# Altium schematic sheet BMS_Logic.SchDoc
size 558 x 431 mm; SheetNumber: 4; SheetTotal: 5
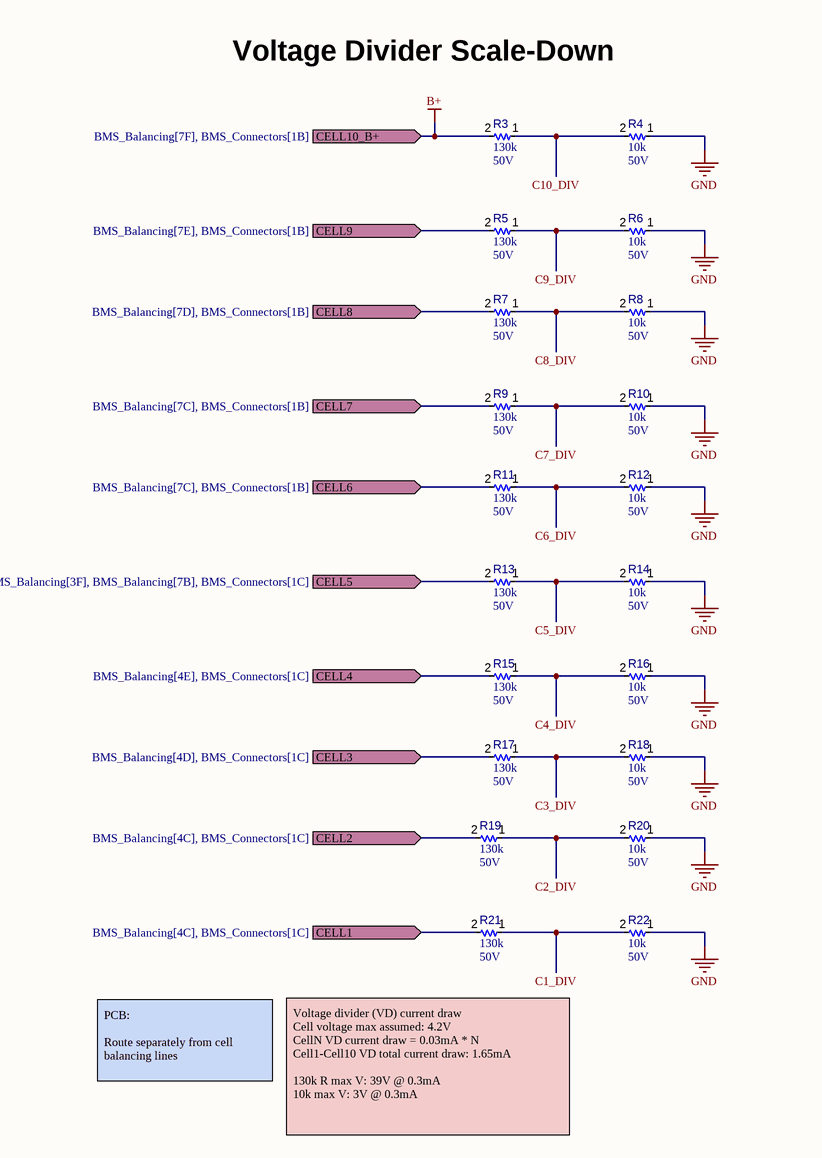
[diagram p0: BMS_Logic.SchDoc, top left]
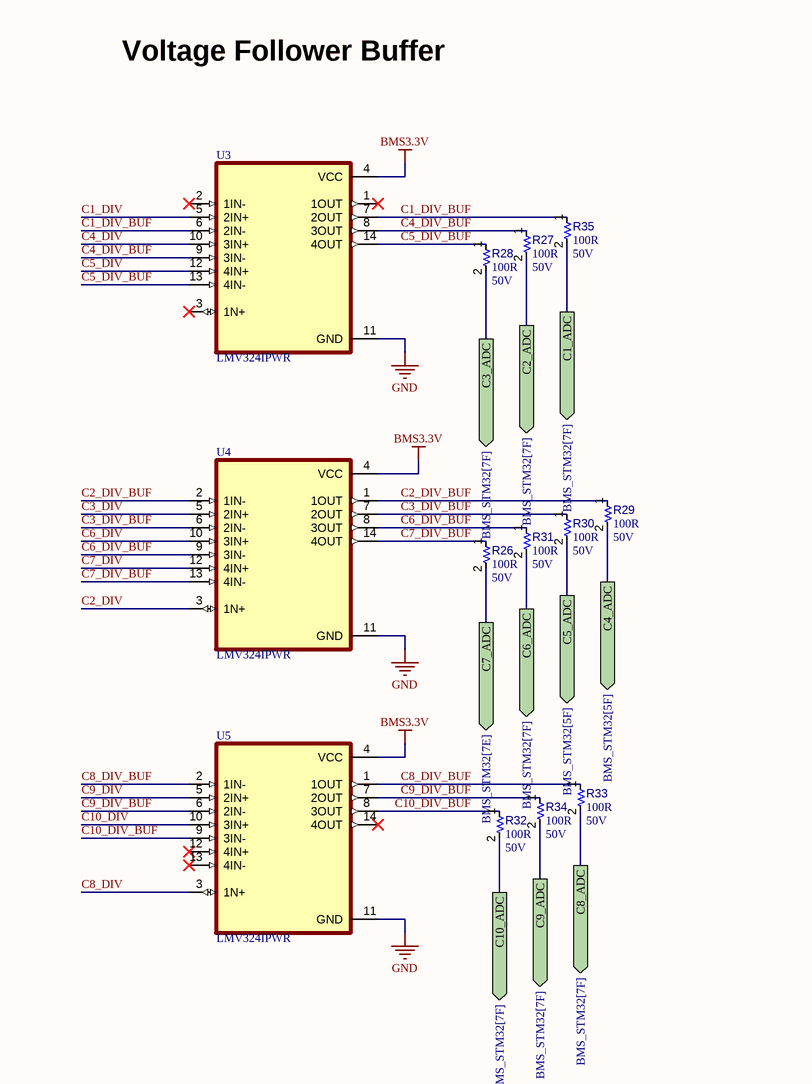
[diagram p1: BMS_Logic.SchDoc, top right]
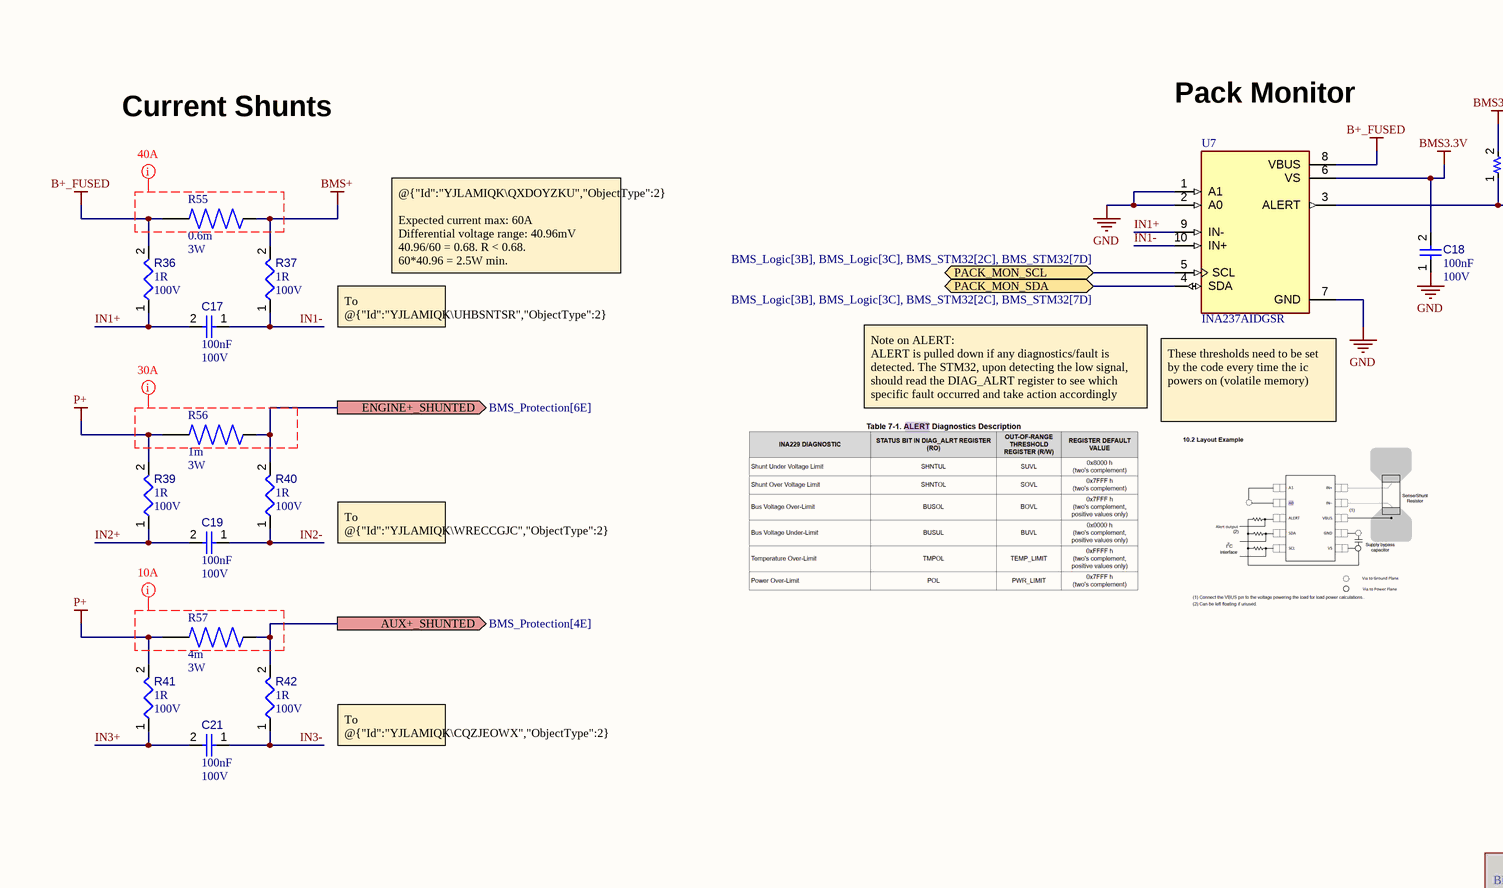
[diagram p2: BMS_Logic.SchDoc, bottom left]
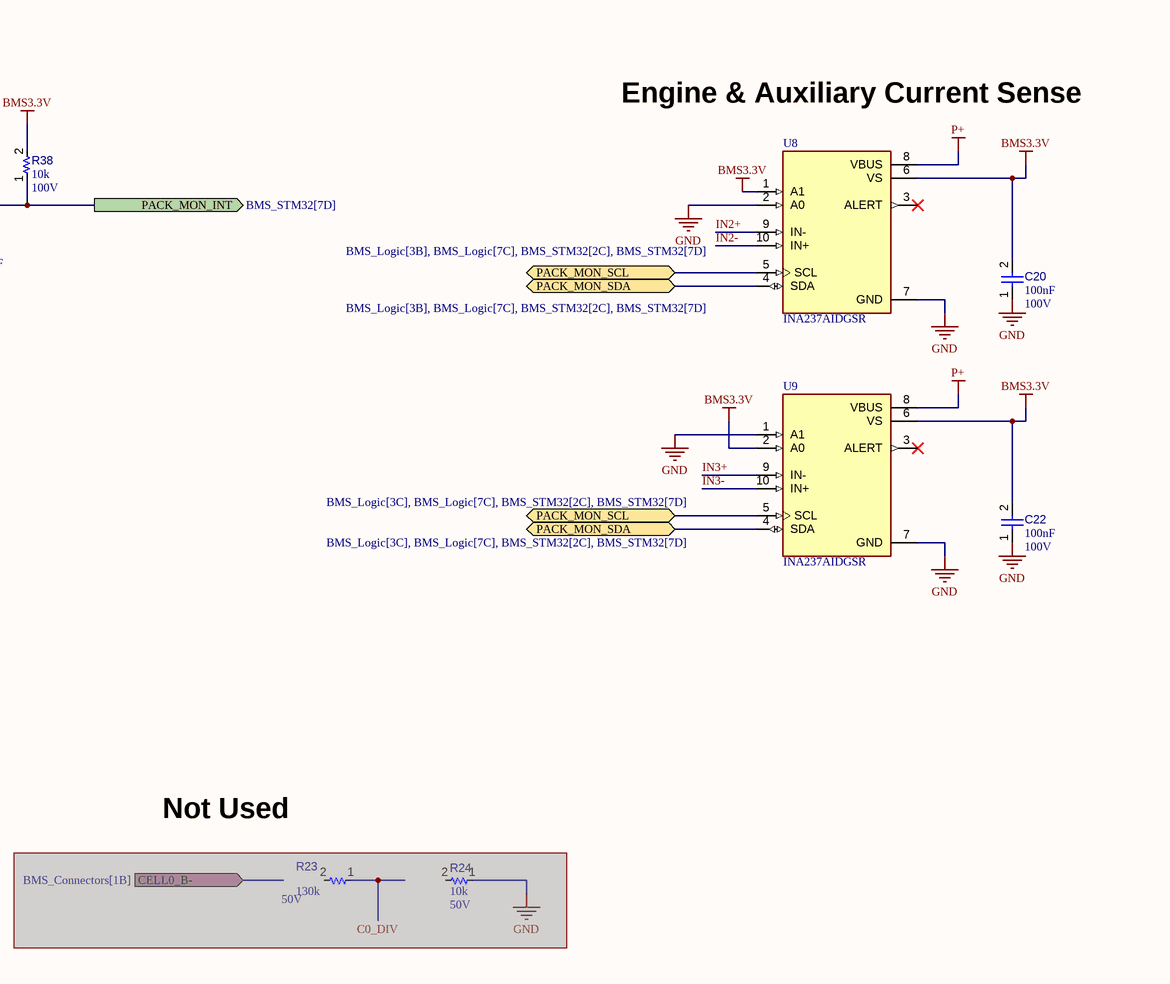
[diagram p3: BMS_Logic.SchDoc, bottom right]

## Parts
C17  value 100nF  Voltage Rating: 100V  [CAPC1608X90X40NL10T20]  (hidden comment: CC0603KRX7R0BB104)
C18  value 100nF  Voltage Rating: 100V  [CAPC1608X90X40NL10T20]  (hidden comment: CC0603KRX7R0BB104)
C19  value 100nF  Voltage Rating: 100V  [CAPC1608X90X40NL10T20]  (hidden comment: CC0603KRX7R0BB104)
C20  value 100nF  Voltage Rating: 100V  [CAPC1608X90X40NL10T20]  (hidden comment: CC0603KRX7R0BB104)
C21  value 100nF  Voltage Rating: 100V  [CAPC1608X90X40NL10T20]  (hidden comment: CC0603KRX7R0BB104)
C22  value 100nF  Voltage Rating: 100V  [CAPC1608X90X40NL10T20]  (hidden comment: CC0603KRX7R0BB104)
R3  value 130k  Voltage Rating: 50V  [RESC0402(1005)_L]  (hidden comment: RC0402FR-07130KL)
R4  value 10k  Voltage Rating: 50V  [RESC0402(1005)_L]  (hidden comment: RC0402FR-0710KL)
R5  value 130k  Voltage Rating: 50V  [RESC0402(1005)_L]  (hidden comment: RC0402FR-07130KL)
R6  value 10k  Voltage Rating: 50V  [RESC0402(1005)_L]  (hidden comment: RC0402FR-0710KL)
R7  value 130k  Voltage Rating: 50V  [RESC0402(1005)_L]  (hidden comment: RC0402FR-07130KL)
R8  value 10k  Voltage Rating: 50V  [RESC0402(1005)_L]  (hidden comment: RC0402FR-0710KL)
R9  value 130k  Voltage Rating: 50V  [RESC0402(1005)_L]  (hidden comment: RC0402FR-07130KL)
R10  value 10k  Voltage Rating: 50V  [RESC0402(1005)_L]  (hidden comment: RC0402FR-0710KL)
R11  value 130k  Voltage Rating: 50V  [RESC0402(1005)_L]  (hidden comment: RC0402FR-07130KL)
R12  value 10k  Voltage Rating: 50V  [RESC0402(1005)_L]  (hidden comment: RC0402FR-0710KL)
R13  value 130k  Voltage Rating: 50V  [RESC0402(1005)_L]  (hidden comment: RC0402FR-07130KL)
R14  value 10k  Voltage Rating: 50V  [RESC0402(1005)_L]  (hidden comment: RC0402FR-0710KL)
R15  value 130k  Voltage Rating: 50V  [RESC0402(1005)_L]  (hidden comment: RC0402FR-07130KL)
R16  value 10k  Voltage Rating: 50V  [RESC0402(1005)_L]  (hidden comment: RC0402FR-0710KL)
R17  value 130k  Voltage Rating: 50V  [RESC0402(1005)_L]  (hidden comment: RC0402FR-07130KL)
R18  value 10k  Voltage Rating: 50V  [RESC0402(1005)_L]  (hidden comment: RC0402FR-0710KL)
R19  value 130k  Voltage Rating: 50V  [RESC0402(1005)_L]  (hidden comment: RC0402FR-07130KL)
R20  value 10k  Voltage Rating: 50V  [RESC0402(1005)_L]  (hidden comment: RC0402FR-0710KL)
R21  value 130k  Voltage Rating: 50V  [RESC0402(1005)_L]  (hidden comment: RC0402FR-07130KL)
R22  value 10k  Voltage Rating: 50V  [RESC0402(1005)_L]  (hidden comment: RC0402FR-0710KL)
R23  value 130k  Voltage Rating: 50V  [RESC0402(1005)_L]  (hidden comment: RC0402FR-07130KL)  (masked out: inside a compile mask, not in the netlist)
R24  value 10k  Voltage Rating: 50V  [RESC0402(1005)_L]  (hidden comment: RC0402FR-0710KL)  (masked out: inside a compile mask, not in the netlist)
R26  value 100R  Voltage Rating: 50V  [RESC0402(1005)_L]  (hidden comment: RC0402FR-07100RL)
R27  value 100R  Voltage Rating: 50V  [RESC0402(1005)_L]  (hidden comment: RC0402FR-07100RL)
R28  value 100R  Voltage Rating: 50V  [RESC0402(1005)_L]  (hidden comment: RC0402FR-07100RL)
R29  value 100R  Voltage Rating: 50V  [RESC0402(1005)_L]  (hidden comment: RC0402FR-07100RL)
R30  value 100R  Voltage Rating: 50V  [RESC0402(1005)_L]  (hidden comment: RC0402FR-07100RL)
R31  value 100R  Voltage Rating: 50V  [RESC0402(1005)_L]  (hidden comment: RC0402FR-07100RL)
R32  value 100R  Voltage Rating: 50V  [RESC0402(1005)_L]  (hidden comment: RC0402FR-07100RL)
R33  value 100R  Voltage Rating: 50V  [RESC0402(1005)_L]  (hidden comment: RC0402FR-07100RL)
R34  value 100R  Voltage Rating: 50V  [RESC0402(1005)_L]  (hidden comment: RC0402FR-07100RL)
R35  value 100R  Voltage Rating: 50V  [RESC0402(1005)_L]  (hidden comment: RC0402FR-07100RL)
R36  value 1R  Voltage Rating: 100V  [RESC0805(2012)_L]  (hidden comment: RC0805FR-071RL)
R37  value 1R  Voltage Rating: 100V  [RESC0805(2012)_L]  (hidden comment: RC0805FR-071RL)
R38  value 10k  Voltage Rating: 100V  [RESC0402(1005)_L]  (hidden comment: ERJ2GEJ103X)
R39  value 1R  Voltage Rating: 100V  [RESC0805(2012)_L]  (hidden comment: RC0805FR-071RL)
R40  value 1R  Voltage Rating: 100V  [RESC0805(2012)_L]  (hidden comment: RC0805FR-071RL)
R41  value 1R  Voltage Rating: 100V  [RESC0805(2012)_L]  (hidden comment: RC0805FR-071RL)
R42  value 1R  Voltage Rating: 100V  [RESC0805(2012)_L]  (hidden comment: RC0805FR-071RL)
R55  value 0.6m  Power: 3W  [RESC6331X75N]  (hidden comment: HoSRX2512-3W-0.6m-0.5%)
R56  value 1m  Power: 3W  [RESC6331X75N]  (hidden comment: Milliohm HoJLR2512-3W-1mR-1%)
R57  value 4m  Power: 3W  [RESC6331X75N]  (hidden comment: Milliohm HoJLR2512-3W-4mR-1%)
U3  LMV324IPWR  [SOP65P640X120-14N]
U4  LMV324IPWR  [SOP65P640X120-14N]
U5  LMV324IPWR  [SOP65P640X120-14N]
U7  INA237AIDGSR  [SOP50P490X110-10N]
U8  INA237AIDGSR  [SOP50P490X110-10N]
U9  INA237AIDGSR  [SOP50P490X110-10N]

## Ports
AUX+_SHUNTED (out, see BMS_Protection[4E]), C1_ADC (out, see BMS_STM32[7F]), C2_ADC (out, see BMS_STM32[7F]), C3_ADC (out, see BMS_STM32[7F]), C4_ADC (out, see BMS_STM32[5F]), C5_ADC (out, see BMS_STM32[5F]), C6_ADC (out, see BMS_STM32[7F]), C7_ADC (out, see BMS_STM32[7E]), C8_ADC (out, see BMS_STM32[7F]), C9_ADC (out, see BMS_STM32[7F]), C10_ADC (out, see BMS_STM32[7F]), CELL0_B- (in, see BMS_Connectors[1B]), CELL1 (in, see BMS_Balancing[4C], BMS_Connectors[1C]), CELL2 (in, see BMS_Balancing[4C], BMS_Connectors[1C]), CELL3 (in, see BMS_Balancing[4D], BMS_Connectors[1C]), CELL4 (in, see BMS_Balancing[4E], BMS_Connectors[1C]), CELL5 (in, see BMS_Balancing[3F], BMS_Balancing[7B], BMS_Connectors[1C]), CELL6 (in, see BMS_Balancing[7C], BMS_Connectors[1B]), CELL7 (in, see BMS_Balancing[7C], BMS_Connectors[1B]), CELL8 (in, see BMS_Balancing[7D], BMS_Connectors[1B]), CELL9 (in, see BMS_Balancing[7E], BMS_Connectors[1B]), CELL10_B+ (in, see BMS_Balancing[7F], BMS_Connectors[1B]), ENGINE+_SHUNTED (out, see BMS_Protection[6E]), PACK_MON_INT (out, see BMS_STM32[7D]), PACK_MON_SCL (bidir, see BMS_Logic[3B], BMS_Logic[3C], BMS_STM32[2C], BMS_STM32[7D]), PACK_MON_SCL (bidir, see BMS_Logic[3B], BMS_Logic[7C], BMS_STM32[2C], BMS_STM32[7D]), PACK_MON_SCL (bidir, see BMS_Logic[3C], BMS_Logic[7C], BMS_STM32[2C], BMS_STM32[7D]), PACK_MON_SDA (bidir, see BMS_Logic[3B], BMS_Logic[3C], BMS_STM32[2C], BMS_STM32[7D]), PACK_MON_SDA (bidir, see BMS_Logic[3B], BMS_Logic[7C], BMS_STM32[2C], BMS_STM32[7D]), PACK_MON_SDA (bidir, see BMS_Logic[3C], BMS_Logic[7C], BMS_STM32[2C], BMS_STM32[7D])

## Nets
B+: R3.2 ; port CELL10_B+
B+_FUSED: R36.2 R55.1 U7.8(VBUS)
BMS3.3V: C18.2 C20.2 C22.2 R38.2 U3.4(VCC) U4.4(VCC) U5.4(VCC) U7.6(VS) U8.1(A1) U8.6(VS) U9.2(A0) U9.6(VS)
BMS+: R37.2 R55.2
GND: C18.1 C20.1 C22.1 R4.1 R6.1 R8.1 R10.1 R12.1 R14.1 R16.1 R18.1 R20.1 R22.1 U3.11(GND) U4.11(GND) U5.11(GND) U7.1(A1) U7.2(A0) U7.7(GND) U8.2(A0) U8.7(GND) U9.1(A1) U9.7(GND)
P+: R39.2 R41.2 R56.1 R57.1 U8.8(VBUS) U9.8(VBUS)
AUX+_SHUNTED: R42.2 R57.2 ; port AUX+_SHUNTED
C1_ADC: R35.2 ; port C1_ADC
C1_DIV: R21.1 R22.2 U3.5(2IN+)
C1_DIV_BUF: R35.1 U3.6(2IN-) U3.7(2OUT)
C2_ADC: R27.2 ; port C2_ADC
C2_DIV: R19.1 R20.2 U4.3(1N+)
C2_DIV_BUF: R29.1 U4.1(1OUT) U4.2(1IN-)
C3_ADC: R28.2 ; port C3_ADC
C3_DIV: R17.1 R18.2 U4.5(2IN+)
C3_DIV_BUF: R30.1 U4.6(2IN-) U4.7(2OUT)
C4_ADC: R29.2 ; port C4_ADC
C4_DIV: R15.1 R16.2 U3.10(3IN+)
C4_DIV_BUF: R27.1 U3.8(3OUT) U3.9(3IN-)
C5_ADC: R30.2 ; port C5_ADC
C5_DIV: R13.1 R14.2 U3.12(4IN+)
C5_DIV_BUF: R28.1 U3.13(4IN-) U3.14(4OUT)
C6_ADC: R31.2 ; port C6_ADC
C6_DIV: R11.1 R12.2 U4.10(3IN+)
C6_DIV_BUF: R31.1 U4.8(3OUT) U4.9(3IN-)
C7_ADC: R26.2 ; port C7_ADC
C7_DIV: R9.1 R10.2 U4.12(4IN+)
C7_DIV_BUF: R26.1 U4.13(4IN-) U4.14(4OUT)
C8_ADC: R33.2 ; port C8_ADC
C8_DIV: R7.1 R8.2 U5.3(1N+)
C8_DIV_BUF: R33.1 U5.1(1OUT) U5.2(1IN-)
C9_ADC: R34.2 ; port C9_ADC
C9_DIV: R5.1 R6.2 U5.5(2IN+)
C9_DIV_BUF: R34.1 U5.6(2IN-) U5.7(2OUT)
C10_ADC: R32.2 ; port C10_ADC
C10_DIV: R3.1 R4.2 U5.10(3IN+)
C10_DIV_BUF: R32.1 U5.8(3OUT) U5.9(3IN-)
CELL1: R21.2 ; port CELL1
CELL2: R19.2 ; port CELL2
CELL3: R17.2 ; port CELL3
CELL4: R15.2 ; port CELL4
CELL5: R13.2 ; port CELL5
CELL6: R11.2 ; port CELL6
CELL7: R9.2 ; port CELL7
CELL8: R7.2 ; port CELL8
CELL9: R5.2 ; port CELL9
ENGINE+_SHUNTED: R40.2 R56.2 ; port ENGINE+_SHUNTED
IN1+: C17.2 R36.1 U7.9(IN-)
IN1-: C17.1 R37.1 U7.10(IN+)
IN2+: C19.2 R39.1 U8.9(IN-)
IN2-: C19.1 R40.1 U8.10(IN+)
IN3+: C21.2 R41.1 U9.9(IN-)
IN3-: C21.1 R42.1 U9.10(IN+)
PACK_MON_INT: R38.1 U7.3(ALERT) ; port PACK_MON_INT
PACK_MON_SCL: U7.5(SCL) U8.5(SCL) U9.5(SCL) ; port PACK_MON_SCL
PACK_MON_SDA: U7.4(SDA) U8.4(SDA) U9.4(SDA) ; port PACK_MON_SDA

Not connected (* = marked no-connect by the designer): U3 1(1OUT)* 2(1IN-)* 3(1N+)*; U5 12(4IN+)* 13(4IN-)* 14(4OUT)*; U8 3(ALERT)*; U9 3(ALERT)*

## Layout directives
mark named 30A: (no net found under the mark)
mark named 40A: (no net found under the mark)
mark named 10A: (no net found under the mark)

## Notes on the sheet
- Voltage Divider Scale-Down
- Voltage Follower Buffer
- PCB:
  Route separately from cell balancing lines
- Voltage divider (VD) current draw
  Cell voltage max assumed: 4.2V
  CellN VD current draw = 0.03mA * N
  Cell1-Cell10 VD total current draw: 1.65mA
  130k R max V: 39V @ 0.3mA
  10k max V: 3V @ 0.3mA
- Pack Monitor
- Engine & Auxiliary Current Sense
- Current Shunts
- @{"Id":"YJLAMIQK\QXDOYZKU","ObjectType":2}
  Expected current max: 60A
  Differential voltage range: 40.96mV
  40.96/60 = 0.68. R < 0.68.
  60*40.96 = 2.5W min.
- To @{"Id":"YJLAMIQK\UHBSNTSR","ObjectType":2}
- Note on ALERT:
  ALERT is pulled down if any diagnostics/fault is detected. The STM32, upon detecting the low signal, should read the DIAG_ALRT register to see which specific fault occurred and take action accordingly
- (near U7) These thresholds need to be set by the code every time the ic powers on (volatile memory)
- To @{"Id":"YJLAMIQK\WRECCGJC","ObjectType":2}
- To @{"Id":"YJLAMIQK\CQZJEOWX","ObjectType":2}
- Not Used
- DWG. NO.
- REV.
- SHT.
- REVISION
- DESCRIPTION
- DATE
- APPROVED
- THIS DOCUMENT AND THE DATA DISCLOSED HEREIN OR HEREWITH IS THE PROPERTY OF ALTIUM LIMITED AND MAY BE FREELY DISTRIBUTED IN WHOLE. NO RIGHTS ARE RESERVED OR EXPRESS OR IMPLIED WARANTEE GIVEN.
- ENG:
- DSN:
- APPROVALS
- PROJECT
- DOCUMENT REVISION:
- DESIGN ITEM:
- CHK:
- BOM:
- REFERENCE DOCUMENTS
- PROJECT REVISION:
- TITLE
- FAB DWG:
- PCB DWG:
- ASSY DWG:
- SCALE:
- SIZE
- C
- CAGE CODE
- FILE NAME
- DWG NO.
- SHEET
- OF
- REV

## Library data of the parts
C17-C22 = CMP-001-00017-6: Chip Capacitor, 100 nF, +/- 10%, 50 V, 0603 (1608 Metric); Capacitor Type: Ceramic; Mounting Technology: SM; Case/Package: 0603; Pins: 2; RoHS Compliant: True; Min Operating Temperature: -55°C; Max Operating Temperature: 125°C; Tolerance: 10%
R3-R24 R26-R35 = CMP-009-00065-4: 100R 0.063W 1% 0402 (1005 Metric)  SMD; Power: 63mW; Mounting Technology: SMT; Case/Package: 0402; Pins: 2; Tolerance: 1%
R36 R37 R39-R42 = CMP-009-00118-3: Chip Resistor, 1 kOhms, +/-5%, 125 mW, -55 to 155 degC, 0805; Tolerance: 5%; Power: 125mW; Case/Package: 0805; Pins: 2; Min Operating Temperature: -55°C; Max Operating Temperature: 155°C
R38 = CMP-009-00065-4: 100R 0.063W 1% 0402 (1005 Metric)  SMD; Power: 100mW; Mounting Technology: SMT; Case/Package: 0402; Pins: 2; Tolerance: 1%
R55 = CMP-009-00180-1: 0 Ohms Jumper 1W Chip Resistor 2512 (6432 Metric) - Thick Film; MF: Bourns; Source: CR2512-J_-000ELF.SchLib; SnapEDA_Link: https://www.snapeda.com/parts/CR2512-J/-000ELF/Bourns/view-part/?ref=snap; MP: CR2512-J/-000ELF; Design Item ID: CR2512-J/-000ELF; Case/Package: 6331 Bourns; Check_prices: https://www.snapeda.com/parts/CR2512-J/-000ELF/Bourns/view-part/?ref=eda
R56 R57 = CMP-009-00180-1: MF: Bourns; Source: CR2512-J_-000ELF.SchLib; SnapEDA_Link: https://www.snapeda.com/parts/CR2512-J/-000ELF/Bourns/view-part/?ref=snap; MP: CR2512-J/-000ELF; Design Item ID: CR2512-J/-000ELF; Case/Package: 6331 Bourns; Check_prices: https://www.snapeda.com/parts/CR2512-J/-000ELF/Bourns/view-part/?ref=eda
U3-U5 = CMP-014-00002-2: Quad, 5.5-V, 1-MHz, RRO operational amplifier; MF: Texas Instruments; Max Supply Current: 1.16mA; Input Offset Voltage-Max: 7mV; Power Supplies: 3/5V; Common-mode Reject Ratio-Nom: 65dB; Voltage Gain-Min: 10000; Slew Rate: 1V/µs; Bias Current-Max (IIB) @25C: 250nA; Unity Gain BW-Nom: 1MHz; Frequency Compensation: YES; Channels: 4; Supply Voltage Limit-Max: 5.5V; Architecture: VOLTAGE-FEEDBACK; Nominal Supply Voltage: 2.7V; Source: LMV324IPWR.SchLib; Value: *; SnapEDA_Link: https://www.snapeda.com/parts/LMV324IPWR/Texas+Instruments/view-part/?ref=snap; Pins: 14; Check_prices: https://www.snapeda.com/parts/LMV324IPWR/Texas+Instruments/view-part/?ref=eda; MP: LMV324IPWR; Component Type: Standard; Design Item ID: LMV324IPWR; Case/Package: TSSOP; Amplifier Type: OPERATIONAL AMPLIFIER; Peak Reflow Temperature (Cel): 260°C; RoHS Compliant: Yes; Height - Seated (Max): 1.2mm; Max Operating Temperature: 125°C; Surface Mount: Yes; Average Bias Current-Max (IIB): 250nA; Width: 4.4mm; Min Operating Temperature: -40°C; Length: 5mm; Temperature Grade: AUTOMOTIVE
U7-U9 = CMP-127-000000-1: 85-V, 16-bit, I2C output current/voltage/power monitor with alert; MF: Texas Instruments; MP: INA237AIDGSR; Value: *; Component Type: Standard; Design Item ID: INA237AIDGSR; SnapEDA_Link: https://www.snapeda.com/parts/INA237AIDGSR/Texas+Instruments/view-part/?ref=snap; Pin Count: 10; Package: VSSOP-10 Texas Instruments; Check_prices: https://www.snapeda.com/parts/INA237AIDGSR/Texas+Instruments/view-part/?ref=eda; Source: INA237AIDGSR.SchLib